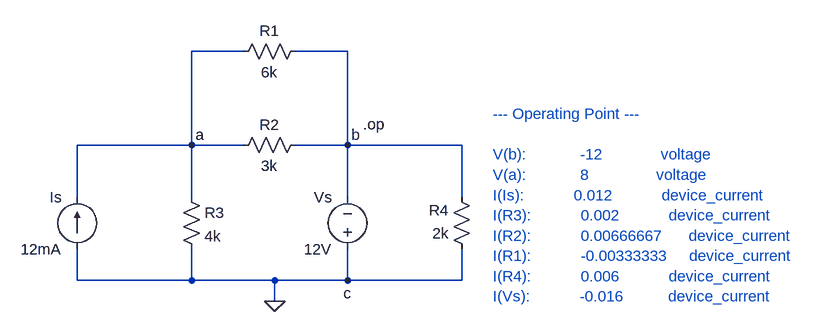
[diagram p0: schematic Q2.asc]
Q2.asc, the LTspice schematic file:
Version 4
SHEET 1 1388 680
WIRE 496 -96 416 -96
WIRE 656 -96 576 -96
WIRE 416 48 416 -96
WIRE 416 48 240 48
WIRE 496 48 416 48
WIRE 656 48 656 -96
WIRE 656 48 576 48
WIRE 832 48 656 48
WIRE 240 128 240 48
WIRE 416 128 416 48
WIRE 656 128 656 48
WIRE 832 128 832 48
WIRE 240 256 240 208
WIRE 416 256 416 208
WIRE 416 256 240 256
WIRE 544 256 416 256
WIRE 656 256 656 208
WIRE 656 256 544 256
WIRE 832 256 832 208
WIRE 832 256 656 256
WIRE 544 288 544 256
FLAG 416 48 a
FLAG 656 48 b
FLAG 656 256 c
FLAG 544 288 0
SYMBOL voltage 656 224 R180
WINDOW 0 24 96 Left 2
WINDOW 3 24 16 Left 2
SYMATTR InstName Vs
SYMATTR Value 12V
SYMBOL current 240 208 R180
WINDOW 0 24 80 Left 2
WINDOW 3 24 0 Left 2
SYMATTR InstName Is
SYMATTR Value 12mA
SYMBOL res 400 112 R0
SYMATTR InstName R3
SYMATTR Value 4k
SYMBOL res 480 64 R270
WINDOW 0 32 56 VTop 2
WINDOW 3 0 56 VBottom 2
SYMATTR InstName R2
SYMATTR Value 3k
SYMBOL res 592 -112 R90
WINDOW 0 0 56 VBottom 2
WINDOW 3 32 56 VTop 2
SYMATTR InstName R1
SYMATTR Value 6k
SYMBOL res 848 224 R180
WINDOW 0 36 76 Left 2
WINDOW 3 36 40 Left 2
SYMATTR InstName R4
SYMATTR Value 2k
TEXT 680 16 Left 2 !.op
TEXT 880 0 Left 2 ;--- Operating Point ---\n \nV(b):            -12             voltage\nV(a):            8               voltage\nI(Is):           0.012           device_current\nI(R3):           0.002           device_current\nI(R2):           0.00666667      device_current\nI(R1):           -0.00333333     device_current\nI(R4):           0.006           device_current\nI(Vs):           -0.016          device_current

The netlist it stands for:
* Q2.asc
Vs 0 b 12V
Is 0 a 12mA
R3 a 0 4k
R2 a b 3k
R1 b a 6k
R4 0 b 2k
.op
* --- Operating Point ---
* V(b):            -12             voltage
* V(a):            8               voltage
* I(Is):           0.012           device_current
* I(R3):           0.002           device_current
* I(R2):           0.00666667      device_current
* I(R1):           -0.00333333     device_current
* I(R4):           0.006           device_current
* I(Vs):           -0.016          device_current
.backanno
.end

* Results of the author's LTspice run, read from the files saved beside the schematic
* Operating Point:
*   V(b) = -12 V
*   V(a) = 8 V
*   I(Is) = 12 mA
*   I(R3) = 2 mA
*   I(R2) = 6.667 mA
*   I(R1) = -3.333 mA
*   I(R4) = 6 mA
*   I(Vs) = -16 mA